# EAGLE design Calunium_v2_smd_2 (EAGLE 6.4)
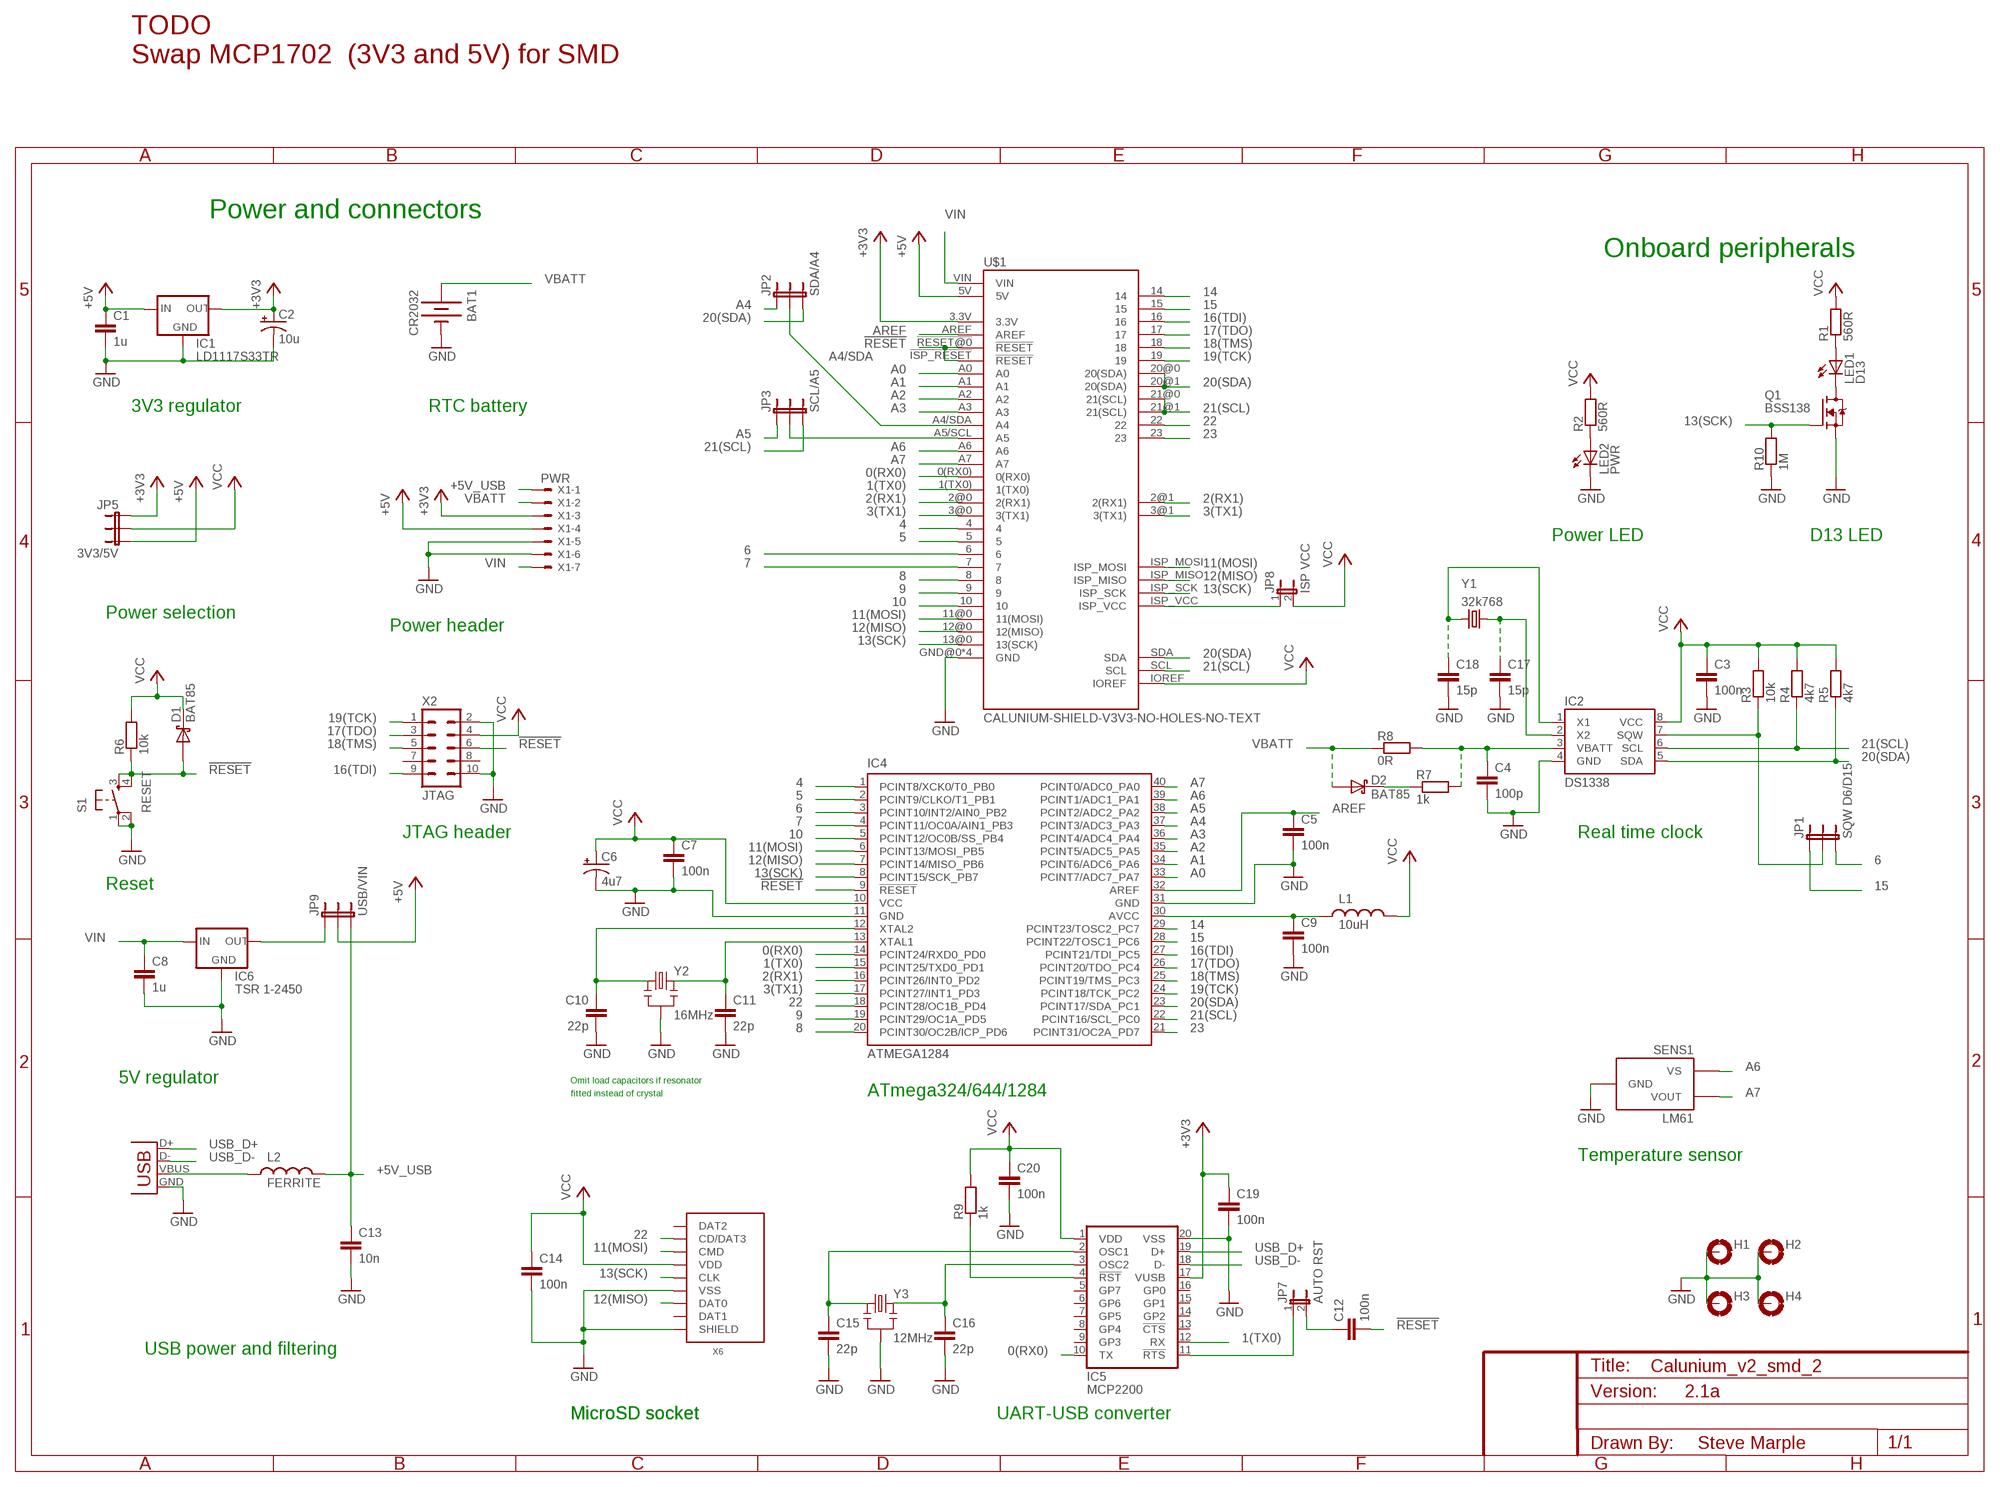
[diagram p0: schematic, sheet 1]

## Parts
BAT1  CR2032  BATTERY20PTH  [BATTCOM_20MM_PTH]
C1  1u  C-EU1206-HAND  [1206-HAND]
C2  10u  CAP_POLPTH2  [CPOL-RADIAL-10UF-25V]
C3  100n  C-EU1206-HAND  [1206-HAND]
C4  100p  C-EU1206-HAND  [1206-HAND]
C5  100n  C-EU1206-HAND  [1206-HAND]
C6  4u7  CAP_POLPTH2  [CPOL-RADIAL-10UF-25V]
C7  100n  C-EU1206-HAND  [1206-HAND]
C8  1u  C-EU1206-HAND  [1206-HAND]
C9  100n  C-EU1206-HAND  [1206-HAND]
C10  22p  C-EU0805-HAND  [0805-HAND]
C11  22p  C-EU0805-HAND  [0805-HAND]
C12  100n  C-EU1206-HAND  [1206-HAND]
C13  10n  C-EU1206-HAND  [1206-HAND]
C14  100n  C-EU1206-HAND  [1206-HAND]
C15  22p  C-EU0805-HAND  [0805-HAND]
C16  22p  C-EU0805-HAND  [0805-HAND]
C17  15p  C-EU0805-HAND  [0805-HAND]
C18  15p  C-EU0805-HAND  [0805-HAND]
C19  100n  C-EU1206-HAND  [1206-HAND]
C20  100n  C-EU1206-HAND  [1206-HAND]
D1  BAT85  DIODE-SCHOTTKYSOT23-1-3-HAND  [SOT23-3-HAND]
D2  BAT85  DIODE-SCHOTTKYSOT23-1-3-HAND  [SOT23-3-HAND]
H1  MOUNT-PAD-ROUND3.0  [3,0-PAD]
H2  MOUNT-PAD-ROUND3.0  [3,0-PAD]
H3  MOUNT-PAD-ROUND3.0  [3,0-PAD]
H4  MOUNT-PAD-ROUND3.0  [3,0-PAD]
IC1  LD1117S33TR  V_REG_LD1117VXXSOT223-HAND  [SOT223-HAND]
IC2  DS1338  DS1307SO08  [SO08]
IC4  ATMEGA1284  ATMEGA644-20PU  [DIL40]
IC5  MCP2200  [SO20]
IC6  TSR 1-2450  V_REG_78XXTSR-1-XXXX  [TSR-1-XXXX]
JP1  SQW D6/D15  JUMPER-3PTH  [1X03]
JP2  SDA/A4  JUMPER-3PTH  [1X03]
JP3  SCL/A5  JUMPER-3PTH  [1X03]
JP5  3V3/5V  JUMPER-3PTH  [1X03]
JP7  AUTO RST  JUMPER-2PTH  [1X02]
JP8  ISP VCC  JUMPER-2PTH  [1X02]
JP9  USB/VIN  JUMPER-3PTH  [1X03]
L1  10uH  INDUCTOR1210-HAND  [1210-HAND]
L2  FERRITE  INDUCTOR0805-HAND  [0805-HAND]
LED1  D13  LED3MM  [LED3MM]
LED2  PWR  LED3MM  [LED3MM]
Q1  BSS138  BSS138SOT23-3-HAND  [SOT23-3-HAND]
R1  560R  RESISTOR1206-HAND  [1206-HAND]
R2  560R  RESISTOR1206-HAND  [1206-HAND]
R3  10k  RESISTOR1206-HAND  [1206-HAND]
R4  4k7  RESISTOR1206-HAND  [1206-HAND]
R5  4k7  RESISTOR1206-HAND  [1206-HAND]
R6  10k  RESISTOR1206-HAND  [1206-HAND]
R7  1k  RESISTOR1206-HAND  [1206-HAND]
R8  0R  RESISTOR1206-HAND  [1206-HAND]
R9  1k  RESISTOR1206-HAND  [1206-HAND]
R10  1M  RESISTOR1206-HAND  [1206-HAND]
S1  RESET  TAC_SWITCHPTH  [TACTILE-PTH]
SENS1  LM61  [TO-92]
U$1  CALUNIUM-SHIELD-V3V3-NO-HOLES-NO-TEXT  [CALUNIUM-SHIELD-NO-OUTLINE-NO-HOLES-NO-TEXT-V3]
X1  PWR  22-23-2071  [22-23-2071]
X2  JTAG  ATMEL-JTAG  [CON-HARTING-ML10]
X3  USB  USBPTH  [USB-B-PTH]
X6  MICRO-SD-SOCKETHIROSE-DM3D  [MICRO-SD-SOCKET-HIROSE-DM3D]
Y1  32k768  CRYSTALTC38H  [TC38H]
Y2  16MHz  CRYSTAL-RESONATOR  [HC49U-V-RESONATOR]
Y3  12MHz  CRYSTAL-RESONATOR  [HC49U-V-RESONATOR]

## Nets
0(RX0): IC4.14(PCINT24/RXD0_PD0) IC5.10(TX) U$1.0(RX0)
1(TX0): IC4.15(PCINT25/TXD0_PD1) IC5.12(RX) U$1.1(TX0)
2(RX1): IC4.16(PCINT26/INT0_PD2) U$1.2@0(2(RX1)) U$1.2@1(2(RX1))
3(TX1): IC4.17(PCINT27/INT1_PD3) U$1.3@0(3(TX1)) U$1.3@1(3(TX1))
4: IC4.1(PCINT8/XCK0/T0_PB0) U$1.4
5: IC4.2(PCINT9/CLKO/T1_PB1) U$1.5
6: IC4.3(PCINT10/INT2/AIN0_PB2) JP1.3 U$1.6
7: IC4.4(PCINT11/OC0A/AIN1_PB3) U$1.7
8: IC4.20(PCINT30/OC2B/ICP_PD6) U$1.8
9: IC4.19(PCINT29/OC1A_PD5) U$1.9
10: IC4.5(PCINT12/OC0B/SS_PB4) U$1.10
11(MOSI): IC4.6(PCINT13/MOSI_PB5) U$1.11@0(11(MOSI)) U$1.ISP_MOSI X6.CMD
12(MISO): IC4.7(PCINT14/MISO_PB6) U$1.12@0(12(MISO)) U$1.ISP_MISO X6.DAT0
13(SCK): IC4.8(PCINT15/SCK_PB7) Q1.1(G) R10.2 U$1.13@0(13(SCK)) U$1.ISP_SCK X6.CLK
14: IC4.29(PCINT23/TOSC2_PC7) U$1.14
15: IC4.28(PCINT22/TOSC1_PC6) JP1.1 U$1.15
16(TDI): IC4.27(PCINT21/TDI_PC5) U$1.16 X2.9(TDI)
17(TDO): IC4.26(PCINT20/TDO_PC4) U$1.17 X2.3(TDO)
18(TMS): IC4.25(PCINT19/TMS_PC3) U$1.18 X2.5(TMS)
19(TCK): IC4.24(PCINT18/TCK_PC2) U$1.19 X2.1(TCK)
20(SDA): IC2.5(SDA) IC4.23(PCINT17/SDA_PC1) JP2.3 R5.1 U$1.20@0(20(SDA)) U$1.20@1(20(SDA)) U$1.SDA
21(SCL): IC2.6(SCL) IC4.22(PCINT16/SCL_PC0) JP3.3 R4.1 U$1.21@0(21(SCL)) U$1.21@1(21(SCL)) U$1.SCL
22: IC4.18(PCINT28/OC1B_PD4) U$1.22 X6.CD/DAT3
23: IC4.21(PCINT31/OC2A_PD7) U$1.23
!MCP2200_RESET: IC5.4(!RST) R9.1
!RESET: C12.2 D1.1(A) IC4.9(!RESET) R6.1 S1.3 S1.4 U$1.!ISP_RESET(!RESET) U$1.!RESET@0(!RESET) X2.6(!SRST)
+3V3 [power]: C2.1(+) C19.1 IC1.2(OUT) IC1.4(OUT) IC5.17(VUSB) JP5.1 U$1.3.3V X1.3
+5V [power]: C1.1 IC1.3(IN) JP5.3 JP9.2 U$1.5V X1.4
+5V_USB [power]: C13.1 JP9.3 L2.2 X1.1
A0: IC4.33(PCINT7/ADC7_PA7) U$1.A0
A1: IC4.34(PCINT6/ADC6_PA6) U$1.A1
A2: IC4.35(PCINT5/ADC5_PA5) U$1.A2
A3: IC4.36(PCINT4/ADC4_PA4) U$1.A3
A4: IC4.37(PCINT3/ADC3_PA3) JP2.1
A4/SDA: JP2.2 U$1.A4/SDA(A4)
A5: IC4.38(PCINT2/ADC2_PA2) JP3.1
A5/SCL: JP3.2 U$1.A5/SCL(A5)
A6: IC4.39(PCINT1/ADC1_PA1) SENS1.1(VS) U$1.A6
A7: IC4.40(PCINT0/ADC0_PA0) SENS1.2(VOUT) U$1.A7
AREF: C5.1 IC4.32(AREF) U$1.AREF
AUTO_RESET: IC5.11(!RTS) JP7.1
AVCC [power]: C9.1 IC4.30(AVCC) L1.1
GND [power]: BAT1.2(-) C1.2 C2.2(-) C3.2 C4.2 C5.2 C6.2(-) C7.2 C8.2 C9.2 C10.2 C11.2 C13.2 C14.2 C15.2 C16.2 C17.2 C18.2 C19.2 C20.2 H1.B3,0(MOUNT) H2.B3,0(MOUNT) H3.B3,0(MOUNT) H4.B3,0(MOUNT) IC1.1(GND) IC2.4(GND) IC4.11(GND) IC4.31(GND) IC5.20(VSS) IC6.GND LED2.K(C) Q1.2(S) R10.1 S1.1 S1.2 SENS1.3(GND) U$1.GND@0(GND) U$1.GND@1(GND) U$1.GND@2(GND) U$1.GND@3(GND) X1.5 X1.6 X2.2(GND) X2.10(GND) X3.GND X6.GND(VSS) X6.SHIELD@0(SHIELD) Y2.GND Y3.GND
N$1: C11.1 IC4.13(XTAL1) Y2.2
N$2: C10.1 IC4.12(XTAL2) Y2.1
N$3: LED1.A R1.1
N$4: LED1.K(C) Q1.3(D)
N$5: C18.1 IC2.1(X1) Y1.2
N$6 [power]: JP8.1 U$1.ISP_VCC
N$7: C16.1 IC5.3(OSC2) Y3.2
N$8: LED2.A R2.1
N$9: D2.3(C) R7.1
N$11: C4.1 IC2.3(VBATT) R7.2 R8.2
N$12: C17.1 IC2.2(X2) Y1.1
N$14: IC6.OUT JP9.1
N$15: C12.1 JP7.2
N$16 [power]: L2.1 X3.VBUS
N$18: C15.1 IC5.2(OSC1) Y3.1
SQW: IC2.7(SQW) JP1.2 R3.1
USB_D+: IC5.19(D+) X3.D+
USB_D-: IC5.18(D-) X3.D-
VBATT: BAT1.1(+) D2.1(A) R8.1 X1.2
VCC [power]: C3.1 C6.1(+) C7.1 C14.1 C20.1 D1.3(C) IC2.8(VCC) IC4.10(VCC) IC5.1(VDD) JP5.2 JP8.2 L1.2 R1.2 R2.2 R3.2 R4.2 R5.2 R6.2 R9.2 U$1.IOREF X2.4(VTREF) X6.VDD
VIN [power]: C8.1 IC6.IN U$1.VIN X1.7
Unconnected: IC5.5(GP7) IC5.6(GP6) IC5.7(GP5) IC5.8(GP4) IC5.9(GP3) IC5.13(!CTS) IC5.14(GP2) IC5.15(GP1) IC5.16(GP0) X2.7(NC) X2.8(NC) X6.DAT1 X6.DAT2

## Notes on the sheet
- TODO
  Swap MCP1702  (3V3 and 5V) for SMD
- Power and connectors
- Onboard peripherals
- 3V3 regulator | RTC battery
- Power LED | D13 LED
- Power selection
- Power header
- JTAG header | Real time clock
- Reset
- 5V regulator | Omit load capacitors if resonator
- fitted instead of crystal | ATmega324/644/1284
- Temperature sensor
- USB power and filtering
- 2.1a
- MicroSD socket | MicroSD socket | UART-USB converter
- Steve Marple

## Library data of the parts
BAT1 = SparkFun:BATTERY: Battery Holders Various common sizes : AA, AAA, 20mm coin cell and 12mm coin cell.
C1 C3-C5 C7-C9 C12-C20 = SteveMarple:C-EU
C2 = SteveMarple:CAP_POL: Capacitor Polarized These are standard SMD and PTH capacitors. Normally 10uF, 47uF, and 100uF in electrolytic and tantalum varieties. Always verify the external diameter of the through hole cap, it varies with capacity, voltage, and manufacturer. The EIA devices should be standard.
C6 = SparkFun:CAP_POL: Capacitor Polarized These are standard SMD and PTH capacitors. Normally 10uF, 47uF, and 100uF in electrolytic and tantalum varieties. Always verify the external diameter of the through hole cap, it varies with capacity, voltage, and manufacturer. The EIA devices should be standard.
C10 C11 = SteveMarple:C-EU; OPTION: Do not fit for ceramic resonator
D1 D2 = SteveMarple:DIODE-SCHOTTKY
H1-H4 = holes:MOUNT-PAD-ROUND: MOUNTING PAD, round
IC1 = SteveMarple:V_REG_LD1117VXX: CHECK PINOUT!!!!!!!!!!!!!!!!!!! LD1117VXX voltage regulator. We carry the 3.3V version (COM-00526) in TO-220 package.
IC2 = SteveMarple:DS1307
IC4 = SteveMarple:ATMEGA644-*PU: 8-bit Microcontroller with 64K Bytes In-System Programmable Flash Auto generated by make-symbol-device-package-bsdl.ulp Rev. 34 Source: http://www.atmel.com/dyn/resources/prod_documents/doc2593.pdf; MPN: ATMEGA644-20PU; OC_FARNELL: 1288340; OC_NEWARK: 23M5060
IC5 = SteveMarple:MCP2200: MCP2200 Microchip USB-UART interface.
IC6 = SteveMarple:V_REG_78XX: Voltage Regulator Standard 7805 5V regulator. IGO (Input Ground Output). Spark Fun Electronics SKU : COM-00107
JP1-JP3 JP5 JP9 = SparkFun:JUMPER-3
JP7 JP8 = SparkFun:JUMPER-2: Jumper Basic 0.1" spaced jumper. Use with breakaway headers.
L1 L2 = SteveMarple:INDUCTOR: Inductors Basic Inductor/Choke - 0603 and 1206. Footprints are not proven and vary greatly between part numbers.
LED1 LED2 = SparkFun:LED: LEDs Standard schematic elements and footprints for 5mm, 3mm, 1206, and 0603 sized LEDs. 5mm - Spark Fun Electronics SKU : COM-00529 (and others)
Q1 = SteveMarple:BSS138: BSS138 FET
R1-R10 = SteveMarple:RESISTOR: 1/4W PTH resistor
S1 = SparkFun:TAC_SWITCH: Momentary Switch Button commonly used for reset or general input. Spark Fun Electronics SKU : COM-00097
SENS1 = SteveMarple:LM61
U$1 = SteveMarple:CALUNIUM-SHIELD-V3
X1 = con-molex:22-23-2071: .100" (2.54mm) Center Header - 7 Pin; MF: MOLEX; MPN: 22-23-2071; OC_FARNELL: 1654534; OC_NEWARK: 56H0445
X2 = SteveMarple:ATMEL-JTAG: ATMEL JTAG header
X3 = SteveMarple:USB: USB Connectors USB-B-PTH is fully proven SKU : PRT-00139 USB-miniB is fully proven SKU : PRT-00587 USB-A-PCB is untested. USB-A-H is throughly reviewed, but untested. Spark Fun Electronics SKU : PRT-00437 USB-B-SMT is throughly reviewed, but untested. Needs silkscreen touching up. USB-A-S has not been used/tested USB-MB-H has not been used/tested
X6 = SteveMarple:MICRO-SD-SOCKET
Y1 = SteveMarple:CRYSTAL: Crystals Various standard crystals. Proven footprints. Spark Fun Electronics SKU : COM-00534
Y2 Y3 = SteveMarple:CRYSTAL-RESONATOR: Crystal/resonator; OPTION: Crystal or ceramic resonator. Max 12MHz for 3V3 operation.

## Net classes
1 power: width 0.381 mm
3 antenna: width 0.61 mm

## Board
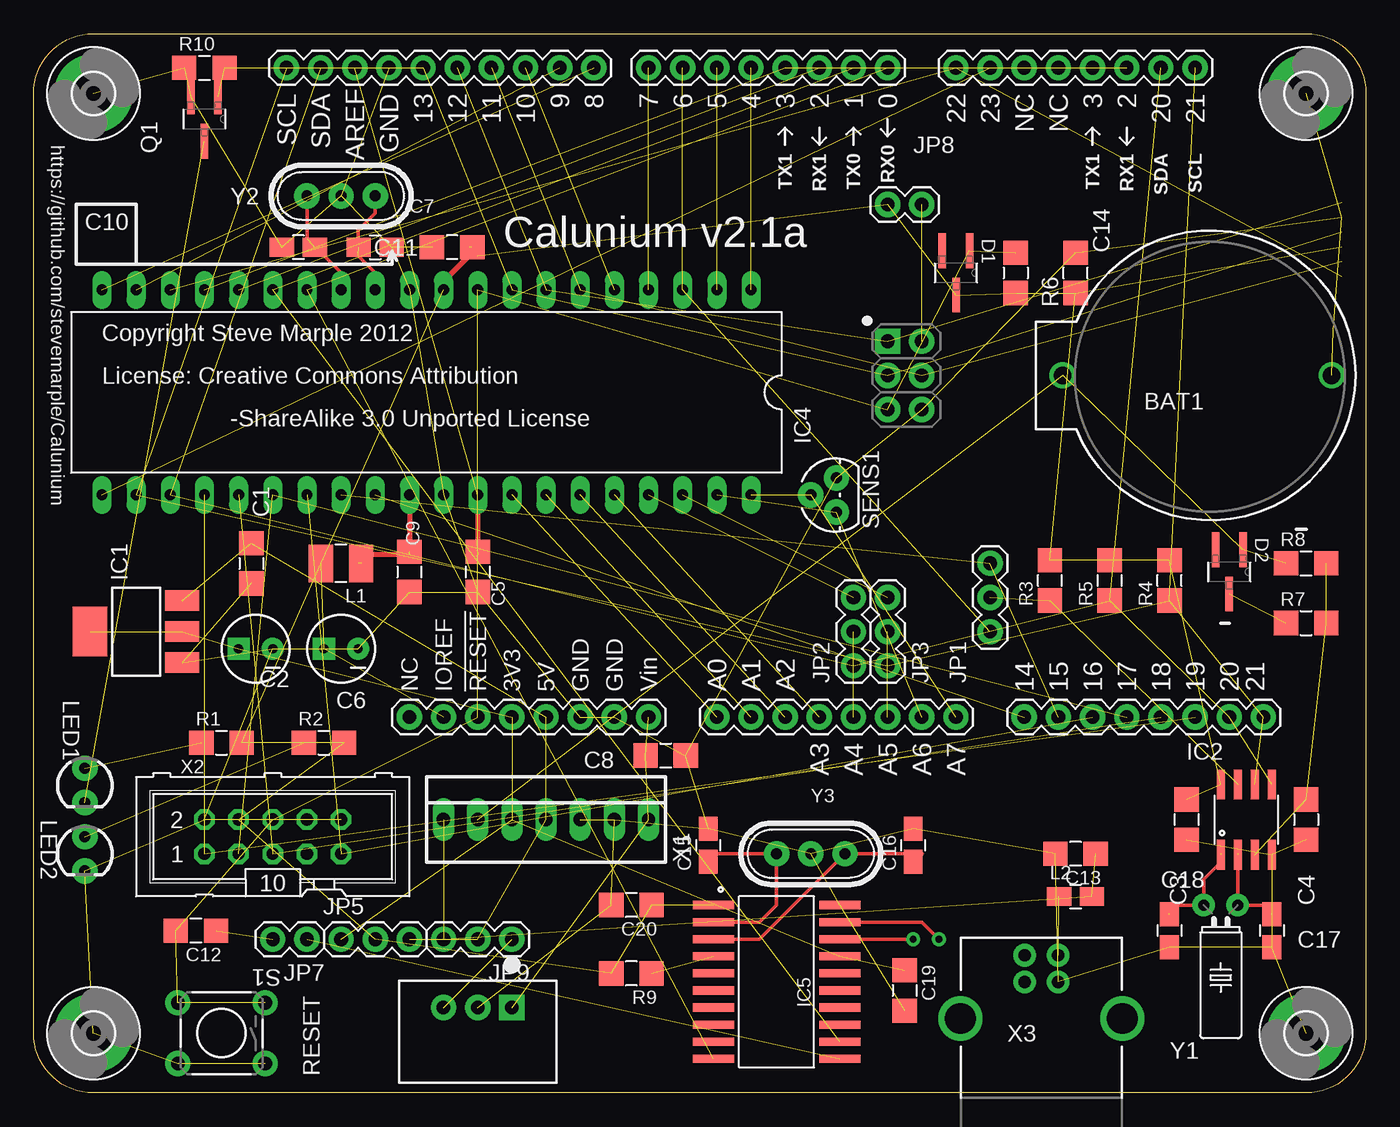
[diagram p1: board, top side]
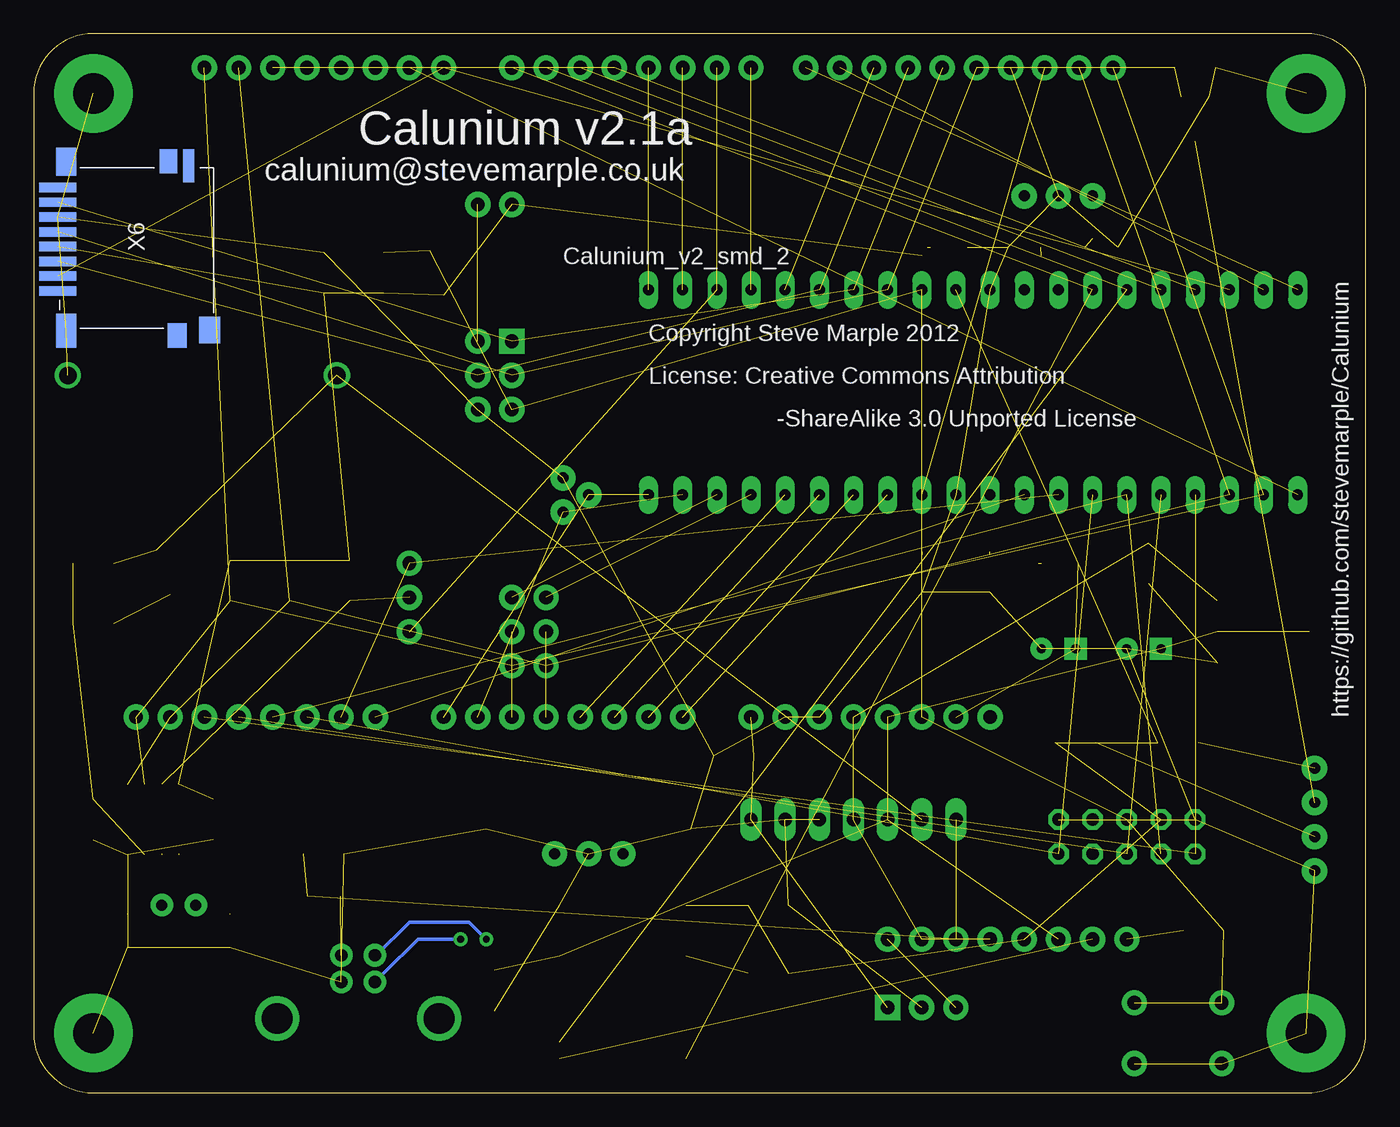
[diagram p2: board, bottom side, seen from below]

Size 99.06 x 78.74 mm. Coordinates in mm from the lower left corner, seen from the top.
Outline: 0,74.3 arc-90 4.45,78.74 94.61,78.74 arc-90 99.06,74.3 99.06,4.45 arc-90 94.61,0 4.45,0 arc-90 0,4.45 0,74.3
Copper layers (1*16): Top 0.035mm / dielectric 1.5mm / Bottom 0.035mm
Design rules "SparkFun_Iteadstudio_10mil": minimum track width 10mil, minimum drill 20mil, track to track 10mil, track to pad 10mil, pad to pad 10mil, via to via 10mil, smd to smd 10mil, copper to edge 0.5mm, drill to drill 8mil, minimum pad ring 12mil, minimum via ring 10mil, stop-mask expansion 4mil, vias tented up to drill 25mil, thermal gap 10mil

### Footprints (pad centres in the part's own frame; a part is rotated, then mirrored left to right if it is on the bottom)
BATTCOM_20MM_PTH = drill 1.3: 1 20,0; 2 0,0
1206-HAND = smd 1.8 x 1.803: 1 -1.499,0; 2 1.499,0
CPOL-RADIAL-10UF-25V = drill 0.7 pad 1.651 square: 1 1.27,0 | drill 0.7 pad 1.651: 2 -1.27,0
0805-HAND = smd 1.8 x 1.4: 1 -1.225,0; 2 1.225,0
SOT23-3-HAND = smd 2.591 x 0.559: 1 -1.651,1.016; 2 -1.651,-1.016; 3 1.651,0
3,0-PAD = drill 3 pad 5.842: B3,0 0,0
SOT223-HAND = smd 1.524 x 2.54: 1 -2.3,-3.429; 2 0,-3.429; 3 2.3,-3.429 | smd 3.683 x 2.54: 4 0,3.429
SO08 = smd 0.61 x 2.21: 1 -1.905,-2.616; 2 -0.635,-2.616; 3 0.635,-2.616; 4 1.905,-2.616; 5 1.905,2.616; 6 0.635,2.616; 7 -0.635,2.616; 8 -1.905,2.616
DIL40 = drill 0.813 long: 1 -24.13,-7.62; 2 -21.59,-7.62; 3 -19.05,-7.62; 4 -16.51,-7.62; 5 -13.97,-7.62; 6 -11.43,-7.62; 7 -8.89,-7.62; 8 -6.35,-7.62; 9 -3.81,-7.62; 10 -1.27,-7.62; 11 1.27,-7.62; 12 3.81,-7.62; 13 6.35,-7.62; 14 8.89,-7.62; 15 11.43,-7.62; 16 13.97,-7.62; 17 16.51,-7.62; 18 19.05,-7.62; 19 21.59,-7.62; 20 24.13,-7.62; 21 24.13,7.62; 22 21.59,7.62; 23 19.05,7.62; 24 16.51,7.62; 25 13.97,7.62; 26 11.43,7.62; 27 8.89,7.62; 28 6.35,7.62; 29 3.81,7.62; 30 1.27,7.62; 31 -1.27,7.62; 32 -3.81,7.62; 33 -6.35,7.62; 34 -8.89,7.62; 35 -11.43,7.62; 36 -13.97,7.62; 37 -16.51,7.62; 38 -19.05,7.62; 39 -21.59,7.62; 40 -24.13,7.62
SO20 = smd 0.61 x 3.048: 1 -5.715,-4.699; 2 -4.445,-4.699; 3 -3.175,-4.699; 4 -1.905,-4.699; 5 -0.635,-4.699; 6 0.635,-4.699; 7 1.905,-4.699; 8 3.175,-4.699; 9 4.445,-4.699; 10 5.715,-4.699; 11 5.715,4.699; 12 4.445,4.699; 13 3.175,4.699; 14 1.905,4.699; 15 0.635,4.699; 16 -0.635,4.699; 17 -1.905,4.699; 18 -3.175,4.699; 19 -4.445,4.699; 20 -5.715,4.699
TSR-1-XXXX = drill 1 pad 1.88: GND 0,0; OUT 2.54,0 | drill 1 pad 1.88 square: IN -2.54,0
1X03 = drill 1.016 pad 1.88: 1 0,0; 2 2.54,0; 3 5.08,0
1X02 = drill 1.016 pad 1.88: 1 0,0; 2 2.54,0
1210-HAND = smd 1.8 x 2.794: 1 -1.499,0; 2 1.499,0
LED3MM = drill 0.813 pad 1.88: A -1.27,0; K 1.27,0
TACTILE-PTH = drill 1.016 pad 1.88: 1 -3.251,2.261; 2 3.251,2.261; 3 -3.251,-2.261; 4 3.251,-2.261
TO-92 = drill 0.813 pad 1.88: 1 -1.27,0; 2 0,1.905; 3 1.27,0
CALUNIUM-SHIELD-NO-OUTLINE-NO-HOLES-NO-TEXT-V3 = drill 1.016 pad 1.88: 0(RX0) 0,21.59; 1(TX0) -2.54,21.59; 2@0 -5.08,21.59; 2@1 17.78,21.59; 3.3V -27.94,-26.67; 3@0 -7.62,21.59; 3@1 15.24,21.59; 4 -10.16,21.59; 5 -12.7,21.59; 5V -25.4,-26.67; 6 -15.24,21.59; 7 -17.78,21.59; 8 -21.844,21.59; 9 -24.384,21.59; 10 -26.924,21.59; 11@0 -29.464,21.59; 12@0 -32.004,21.59; 13@0 -34.544,21.59; 14 10.16,-26.67; 15 12.7,-26.67; 16 15.24,-26.67; 17 17.78,-26.67; 18 20.32,-26.67; 19 22.86,-26.67; 20@0 25.4,-26.67; 20@1 20.32,21.59; 21@0 27.94,-26.67; 21@1 22.86,21.59; 22 5.08,21.59; 23 7.62,21.59; !ISP_RESET 0,-3.81; !RESET@0 -30.48,-26.67; A0 -12.7,-26.67; A1 -10.16,-26.67; A2 -7.62,-26.67; A3 -5.08,-26.67; A4/SDA -2.54,-26.67; A5/SCL 0,-26.67; A6 2.54,-26.67; A7 5.08,-26.67; AREF -39.624,21.59; GND@0 -22.86,-26.67; GND@1 -20.32,-26.67; GND@2 -37.084,21.59; GND@3 2.54,-3.81; IOREF -33.02,-26.67; ISP_MOSI 2.54,-1.27; ISP_SCK 0,-1.27; ISP_VCC 2.54,1.27; NC -35.56,-26.67; NC@0 12.7,21.59; NC@1 10.16,21.59; SCL -44.704,21.59; SDA -42.164,21.59; VIN -17.78,-26.67 | drill 1.016 pad 1.88 square: ISP_MISO 0,1.27
22-23-2071 = drill 1 long: 1 -7.62,0; 2 -5.08,0; 3 -2.54,0; 4 0,0; 5 2.54,0; 6 5.08,0; 7 7.62,0
CON-HARTING-ML10 = drill 0.914 octagon: 1 -5.08,-1.27; 2 -5.08,1.27; 3 -2.54,-1.27; 4 -2.54,1.27; 5 0,-1.27; 6 0,1.27; 7 2.54,-1.27; 8 2.54,1.27; 9 5.08,-1.27; 10 5.08,1.27
USB-B-PTH = drill 0.914 pad 1.676: D+ 0,1.25; D- 1.981,1.25; GND 0,-1.25; VBUS 1.981,-1.25 | drill 2.286: S1 -2.718,-6.02; S2 -2.718,6.02
MICRO-SD-SOCKET-HIROSE-DM3D = smd 0.7 x 2.75: CD/DAT3 6.6,-1.375; CLK 3.3,-1.375; CMD 5.5,-1.375; DAT0 1.1,-1.375; DAT1 0,-1.375; DAT2 7.7,-1.375; GND 2.2,-1.375; VDD 4.4,-1.375 | smd 1.8 x 1.3: P$11 -1.95,6.85 | smd 2.45 x 0.8: P$12 -1.625,8.35 | smd 1.8 x 1.4: P$13 11,7.5 | smd 2 x 1.55: P$14 10.6,9.925 | smd 2.5 x 1.5: SHIELD@0 10.65,-0.75 | smd 2.1 x 1.5: SHIELD@1 -1.9,-0.75
TC38H = drill 0.813 pad 1.676: 1 -1.27,0; 2 1.27,0
HC49U-V-RESONATOR = drill 0.813 pad 1.88: 1 -2.54,0; 2 2.54,0; GND 0,0

### Placement (x,y rotation side)
BAT1  96.52,53.34 180 top
C1  16.19,39.37 270 top
C2  16.51,33.02 180 top
C3  85.72,20.32 270 top
C4  94.61,20.32 270 top
C5  33.02,38.73 270 top
C6  22.86,33.02 180 top
C7  31.11,62.87 180 top
C8  46.99,25.08 0 top
C9  27.94,38.73 270 top
C10  25.4,62.87 0 top
C11  19.68,62.87 180 top
C12  12.06,12.06 180 top
C13  77.47,17.78 180 top
C14  77.47,60.96 90 top
C15  50.16,18.41 90 top
C16  65.41,18.41 90 top
C17  92.08,12.06 270 top
C18  84.45,12.06 270 top
C19  64.77,7.62 270 top
C20  44.45,13.97 180 top
D1  68.58,60.96 270 top
D2  88.9,38.73 270 top
H1  94.61,4.45 0 top
H2  4.45,4.45 0 top
H3  4.45,74.3 0 top
H4  94.61,74.3 0 top
IC1  7.62,34.29 90 top
IC2  90.17,20.32 0 top
IC4  29.21,52.07 180 top
IC5  55.24,8.26 270 top
IC6  33.02,6.35 180 top
JP1  71.12,39.37 270 top
JP2  60.96,36.83 270 top
JP3  63.5,36.83 270 top
JP5  22.86,11.43 0 top
JP7  20.32,11.43 180 top
JP8  66.04,66.04 180 top
JP9  35.56,11.43 180 top
L1  22.86,39.37 180 top
L2  77.47,14.61 0 top
LED1  3.81,22.86 270 top
LED2  3.81,17.78 270 top
Q1  12.7,72.39 270 top
R1  13.97,26.04 0 top
R2  21.59,26.04 0 top
R3  75.56,38.1 90 top
R4  84.45,38.1 90 top
R5  80.01,38.1 90 top
R6  73.03,60.96 270 top
R7  94.61,34.92 0 top
R8  94.61,39.37 0 top
R9  44.45,8.89 180 top
R10  12.7,76.2 0 top
S1  13.97,4.45 180 top
SENS1  59.69,44.45 90 top
U$1  63.5,54.61 0 top
X1  38.1,20.32 0 top
X2  17.78,19.05 0 top
X3  74.93,8.26 90 top
X6  95.89,67.31 270 bottom
Y1  88.27,13.97 180 top
Y2  22.86,66.67 180 top
Y3  57.78,17.78 0 top

### Tracks (layer width: path | path; a pad name or v marks a point on that pad's centre or on a via)
0(RX0)  (2 unrouted)
1(TX0)  (2 unrouted)
2(RX1)  (2 unrouted)
3(TX1)  (2 unrouted)
4  (1 unrouted)
5  (1 unrouted)
6  (2 unrouted)
7  (1 unrouted)
8  (1 unrouted)
9  (1 unrouted)
10  (1 unrouted)
11(MOSI)  (3 unrouted)
12(MISO)  (3 unrouted)
13(SCK)  (5 unrouted)
14  (1 unrouted)
15  (2 unrouted)
16(TDI)  (2 unrouted)
17(TDO)  (2 unrouted)
18(TMS)  (2 unrouted)
19(TCK)  (2 unrouted)
20(SDA)  (6 unrouted)
21(SCL)  (6 unrouted)
22  (2 unrouted)
23  (1 unrouted)
!MCP2200_RESET  (1 unrouted)
!RESET  (8 unrouted)
+3V3  (7 unrouted)
+5V  (5 unrouted)
+5V_USB  (3 unrouted)
A0  (1 unrouted)
A1  (1 unrouted)
A2  (1 unrouted)
A3  (1 unrouted)
A4  (1 unrouted)
A4/SDA  (1 unrouted)
A5  (1 unrouted)
A5/SCL  (1 unrouted)
A6  (2 unrouted)
A7  (2 unrouted)
AREF  (2 unrouted)
  Top 0.381: IC4.32 33.02,40.64 33.02,40.01
AUTO_RESET  (1 unrouted)
AVCC  (2 unrouted)
  Top 0.381: IC4.30 27.94,40.01 24.13,40.01 24.13,39.37 24.77,39.37
GND  (48 unrouted)
N$1  (1 unrouted)
  Top 0.254: Y2.2 20.32,63.5 22.86,60.96 IC4.13
N$2  (1 unrouted)
  Top 0.254: Y2.1 25.4,65.41 24.13,64.14 24.13,62.23 25.4,60.96 IC4.12
N$3  (1 unrouted)
N$4  (1 unrouted)
N$5  (2 unrouted)
  Top 0.254: 88.27,17.78 88.27,17.14 87,15.88 Y1.2 84.45,13.97 84.45,13.34
N$6  (1 unrouted)
N$7
  Top 0.254: IC5.3 53.98,11.43 Y3.2 66.08,17.78 C16.1
N$8  (1 unrouted)
N$9  (1 unrouted)
N$11  (3 unrouted)
N$12  (2 unrouted)
  Top 0.254: 89.53,17.78 Y1.1 92.08,13.97 92.08,13.34
N$14  (1 unrouted)
N$15  (1 unrouted)
N$16  (1 unrouted)
N$18
  Top 0.254: IC5.2 53.98,12.7 55.24,13.97 Y3.1 50.12,17.78 C15.1
SQW  (2 unrouted)
USB_D+  (via drill 0.51)
  Top 0.254: IC5.19 66.04,12.7 v67.31,11.43
  Bottom 0.254: X3.D+ 73.03,8.89 70.48,11.43 v67.31,11.43
USB_D-  (via drill 0.51)
  Top 0.254: IC5.18 v65.41,11.43
  Bottom 0.254: X3.D- 73.66,10.16 71.12,12.7 66.67,12.7 v65.41,11.43
VBATT  (3 unrouted)
VCC  (21 unrouted)
  Top 0.381: IC4.10 30.48,60.33 32.38,62.23 32.38,62.87 33.02,62.23
VIN  (3 unrouted)

### Text on the board
tPlace: TX1 | RX1 | TX0 | RX0 | TX1 | RX1 | SDA | SCL
tNames: RESET
bNames: S/N
tValues: MHz
_tsilk: AREF | SCL | SDA | GND | 13 | 12 | 11 | 10 | 9 | 8 | 7 | 6 | 5 | 4 | 3 | 2 | 1 | 0 | 22 | 23 | NC | NC | 3 | 2 | 20 | 21 | https://github.com/stevemarple/Calunium | Calunium v2.1a | Copyright Steve Marple 2012 | License: Creative Commons Attribution | -ShareAlike 3.0 Unported License | NC | IOREF | !RESET | 3V3 | 5V | GND | GND | Vin | A0 | A1 | A2 | 14 | 15 | 16 | 17 | 18 | 19 | 20 | 21 | A3 | A4 | A5 | A6 | A7
_bsilk: Calunium v2.1a | calunium@stevemarple.co.uk | Copyright Steve Marple 2012 | License: Creative Commons Attribution | -ShareAlike 3.0 Unported License | https://github.com/stevemarple/Calunium